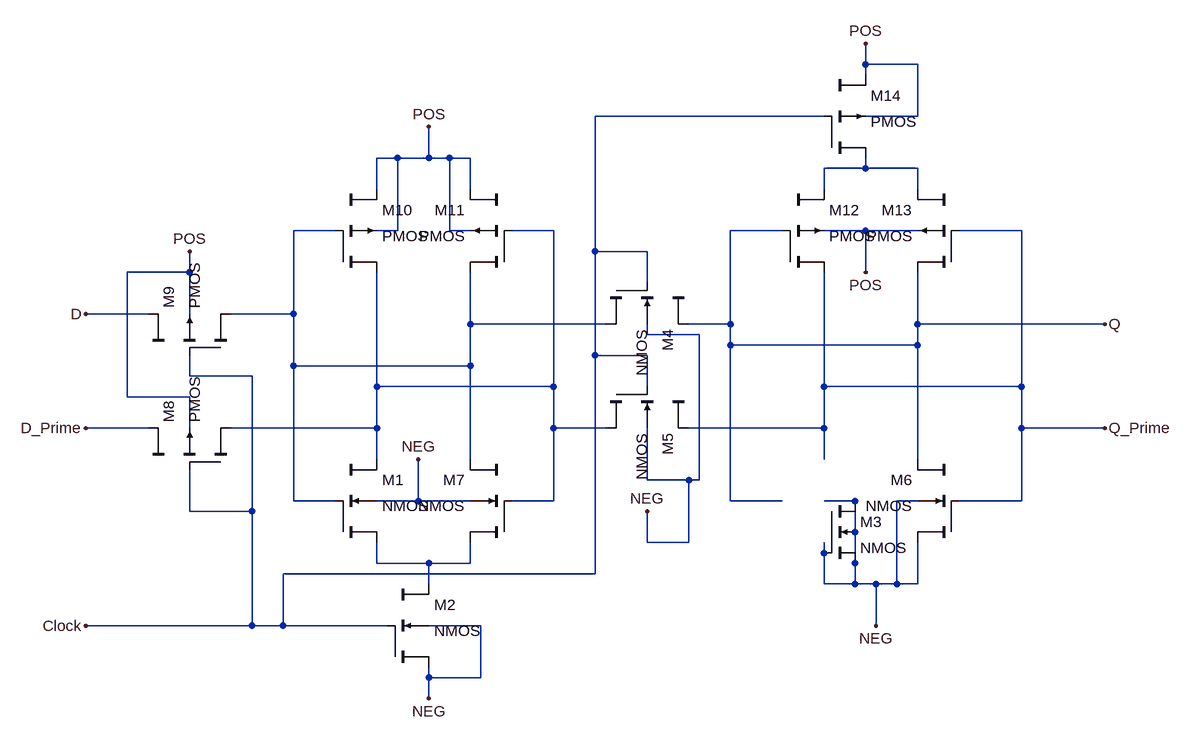
[diagram p0: schematic CRSL_D_FlipFlop.asc]
CRSL_D_FlipFlop.asc, the LTspice schematic file:
Version 4
SHEET 1 1248 824
WIRE 752 -256 752 -288
WIRE 832 -256 752 -256
WIRE 752 -240 752 -256
WIRE 688 -176 336 -176
WIRE 832 -176 832 -256
WIRE 832 -176 752 -176
WIRE 32 -112 0 -112
WIRE 80 -112 80 -160
WIRE 80 -112 32 -112
WIRE 112 -112 80 -112
WIRE 144 -112 112 -112
WIRE 752 -96 752 -112
WIRE 752 -96 688 -96
WIRE 832 -96 752 -96
WIRE 0 -64 0 -112
WIRE 144 -64 144 -112
WIRE 688 -64 688 -96
WIRE 832 -64 832 -96
WIRE -64 0 -128 0
WIRE 32 0 32 -112
WIRE 32 0 0 0
WIRE 112 0 112 -112
WIRE 144 0 112 0
WIRE 272 0 208 0
WIRE 624 0 544 0
WIRE 752 0 688 0
WIRE 832 0 752 0
WIRE 992 0 896 0
WIRE 336 32 336 -176
WIRE 416 32 336 32
WIRE -288 64 -288 32
WIRE -288 64 -384 64
WIRE 752 64 752 0
WIRE 416 80 416 32
WIRE -352 128 -448 128
WIRE -288 128 -288 64
WIRE -128 128 -128 0
WIRE -128 128 -224 128
WIRE 144 144 144 64
WIRE 352 144 144 144
WIRE 544 144 544 0
WIRE 544 144 480 144
WIRE 832 144 832 64
WIRE 1120 144 832 144
WIRE 416 160 416 144
WIRE 496 160 416 160
WIRE 544 176 544 144
WIRE 832 176 832 144
WIRE 832 176 544 176
WIRE 336 192 336 32
WIRE 416 192 336 192
WIRE -128 208 -128 128
WIRE 144 208 144 144
WIRE 144 208 -128 208
WIRE -288 224 -288 192
WIRE -192 224 -288 224
WIRE 0 240 0 64
WIRE 272 240 272 0
WIRE 272 240 0 240
WIRE 416 240 416 192
WIRE 688 240 688 64
WIRE 992 240 992 0
WIRE 992 240 688 240
WIRE -384 256 -384 64
WIRE -288 256 -384 256
WIRE -352 304 -448 304
WIRE -288 304 -288 256
WIRE 0 304 0 240
WIRE 0 304 -224 304
WIRE 272 304 272 240
WIRE 352 304 272 304
WIRE 688 304 688 240
WIRE 688 304 480 304
WIRE 992 304 992 240
WIRE 1120 304 992 304
WIRE 0 352 0 304
WIRE 144 352 144 208
WIRE 688 352 688 304
WIRE 832 352 832 176
WIRE 416 384 416 304
WIRE 480 384 416 384
WIRE 496 384 496 160
WIRE 496 384 480 384
WIRE -128 416 -128 208
WIRE -64 416 -128 416
WIRE 64 416 64 352
WIRE 64 416 0 416
WIRE 144 416 64 416
WIRE 272 416 272 304
WIRE 272 416 208 416
WIRE 544 416 544 176
WIRE 624 416 544 416
WIRE 736 416 688 416
WIRE 832 416 800 416
WIRE 992 416 992 304
WIRE 992 416 896 416
WIRE -288 432 -288 368
WIRE -192 432 -192 224
WIRE -192 432 -288 432
WIRE 416 480 416 432
WIRE 480 480 480 384
WIRE 480 480 416 480
WIRE 0 512 0 480
WIRE 80 512 0 512
WIRE 144 512 144 480
WIRE 144 512 80 512
WIRE 336 528 336 192
WIRE 336 528 -144 528
WIRE 80 544 80 512
WIRE 688 544 688 480
WIRE 736 544 736 416
WIRE 736 544 688 544
WIRE 768 544 736 544
WIRE 800 544 800 416
WIRE 800 544 768 544
WIRE 832 544 832 480
WIRE 832 544 800 544
WIRE -192 608 -192 432
WIRE -192 608 -448 608
WIRE -144 608 -144 528
WIRE -144 608 -192 608
WIRE 16 608 -144 608
WIRE 160 608 80 608
WIRE 768 608 768 544
WIRE 80 688 80 672
WIRE 160 688 160 608
WIRE 160 688 80 688
WIRE 80 720 80 688
FLAG 80 -160 POS
FLAG 752 -288 POS
FLAG -448 128 D
FLAG -448 304 D_Prime
FLAG 1120 144 Q
FLAG 1120 304 Q_Prime
FLAG -448 608 Clock
FLAG 80 720 NEG
FLAG 768 608 NEG
FLAG -288 32 POS
FLAG 752 64 POS
FLAG 64 352 NEG
FLAG 416 432 NEG
SYMBOL cktsym\\nmos4 0 416 R0
SYMATTR InstName M1
SYMATTR SpiceModel ""
SYMATTR Value2 l=.6u w=3u
SYMATTR SpiceLine ""
SYMATTR SpiceLine2 ""
SYMBOL cktsym\\nmos4 416 144 R90
SYMATTR InstName M4
SYMATTR SpiceModel ""
SYMATTR Value2 l=2.4u w=3u
SYMATTR SpiceLine ""
SYMATTR SpiceLine2 ""
SYMBOL cktsym\\nmos4 416 304 R90
SYMATTR InstName M5
SYMATTR SpiceModel ""
SYMATTR Value2 l=2.4u w=3u
SYMATTR SpiceLine ""
SYMATTR SpiceLine2 ""
SYMBOL cktsym\\pmos4 -288 304 R270
SYMATTR InstName M8
SYMATTR SpiceModel ""
SYMATTR Value2 l=2.4u w=4.2u
SYMATTR SpiceLine ""
SYMATTR SpiceLine2 ""
SYMBOL cktsym\\pmos4 -288 128 R270
SYMATTR InstName M9
SYMATTR SpiceModel ""
SYMATTR Value2 l=2.4u w=4.2u
SYMATTR SpiceLine ""
SYMATTR SpiceLine2 ""
SYMBOL cktsym\\pmos4 0 0 R0
SYMATTR InstName M10
SYMATTR SpiceModel ""
SYMATTR Value2 l=.6u w=4.2u
SYMATTR SpiceLine ""
SYMATTR SpiceLine2 ""
SYMBOL cktsym\\pmos4 144 0 M0
SYMATTR InstName M11
SYMATTR SpiceModel ""
SYMATTR Value2 l=.6u w=4.2u
SYMATTR SpiceLine ""
SYMATTR SpiceLine2 ""
SYMBOL cktsym\\pmos4 688 0 R0
SYMATTR InstName M12
SYMATTR SpiceModel ""
SYMATTR Value2 l=.6u w=4.2u
SYMATTR SpiceLine ""
SYMATTR SpiceLine2 ""
SYMBOL cktsym\\pmos4 832 0 M0
SYMATTR InstName M13
SYMATTR SpiceModel ""
SYMATTR Value2 l=.6u w=4.2u
SYMATTR SpiceLine ""
SYMATTR SpiceLine2 ""
SYMBOL cktsym\\pmos4 752 -176 R0
SYMATTR InstName M14
SYMATTR SpiceModel ""
SYMATTR Value2 l=.6u w=4.2u
SYMATTR SpiceLine ""
SYMATTR SpiceLine2 ""
SYMBOL cktsym\\nmos4 80 608 R0
SYMATTR InstName M2
SYMATTR SpiceModel ""
SYMATTR Value2 l=.6u w=3u
SYMATTR SpiceLine ""
SYMATTR SpiceLine2 ""
SYMBOL cktsym\\nmos4 688 416 R0
SYMATTR InstName M3
SYMATTR SpiceModel ""
SYMATTR Value2 l=.6u w=3u
SYMATTR SpiceLine ""
SYMATTR SpiceLine2 ""
SYMBOL cktsym\\nmos4 832 416 M0
SYMATTR InstName M6
SYMATTR SpiceModel ""
SYMATTR Value2 l=.6u w=3u
SYMATTR SpiceLine ""
SYMATTR SpiceLine2 ""
SYMBOL cktsym\\nmos4 144 416 M0
SYMATTR InstName M7
SYMATTR SpiceModel ""
SYMATTR Value2 l=.6u w=3u
SYMATTR SpiceLine ""
SYMATTR SpiceLine2 ""

The netlist it stands for:
* CRSL_D_FlipFlop.asc
M1 N003 N002 N004 NEG NMOS l=.6u w=3u
M4 Q Clock N002 NEG NMOS l=2.4u w=3u
M5 Q_Prime Clock N003 NEG NMOS l=2.4u w=3u
M8 N003 Clock D_Prime POS PMOS l=2.4u w=4.2u
M9 N002 Clock D POS PMOS l=2.4u w=4.2u
M10 N003 N002 POS POS PMOS l=.6u w=4.2u
M11 N002 N003 POS POS PMOS l=.6u w=4.2u
M12 Q_Prime Q N001 POS PMOS l=.6u w=4.2u
M13 Q Q_Prime N001 POS PMOS l=.6u w=4.2u
M14 N001 Clock POS POS PMOS l=.6u w=4.2u
M2 N004 Clock NEG NEG NMOS l=.6u w=3u
M3 NEG NEG NEG NEG NMOS l=.6u w=3u
M6 Q Q_Prime NEG NEG NMOS l=.6u w=3u
M7 N002 N003 N004 NEG NMOS l=.6u w=3u
.model NMOS NMOS
.model PMOS PMOS
.lib standard.mos
.backanno
.end